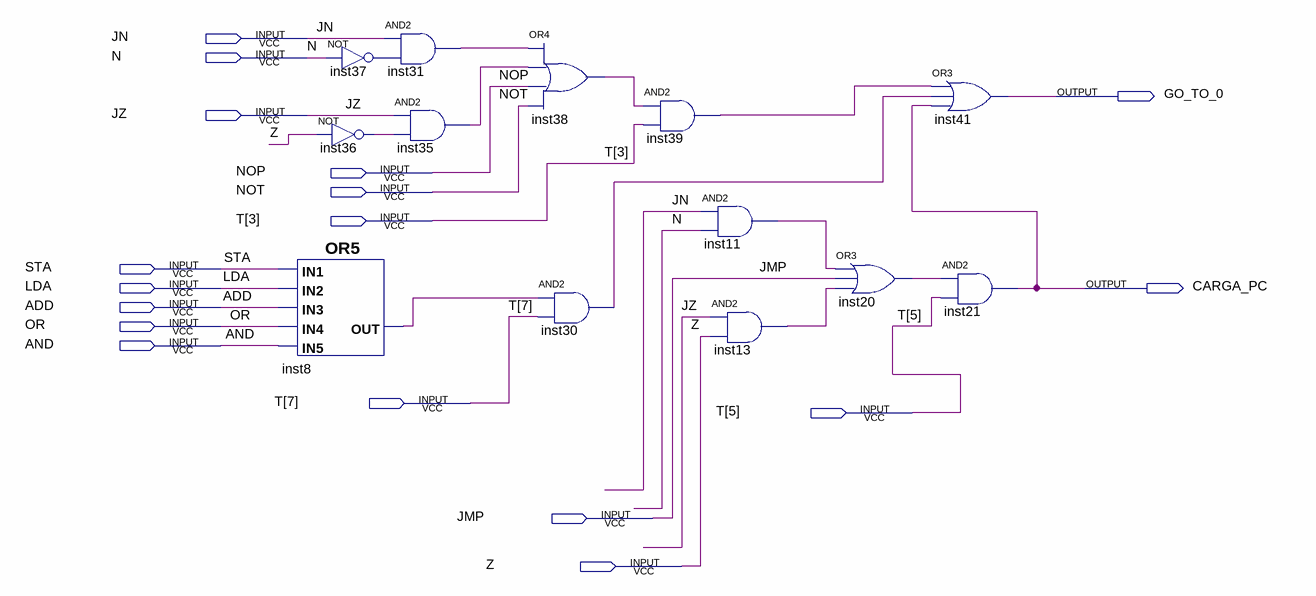
[diagram p0: schematic sheet]
// Quartus schematic UNIDADE_CONTROLE_GOTO0_CARGA_PC.bdf as structural Verilog: 13 symbols, 17 pins
module UNIDADE_CONTROLE_GOTO0_CARGA_PC (
  input  JN,
  input  N,
  input  JZ,
  input  NOP,
  input  NOT,
  input  [7:3] T,
  input  STA,
  input  LDA,
  input  ADD,
  input  OR,
  input  AND,
  input  JMP,
  input  Z,
  output GO_TO_0,
  output CARGA_PC
);

  wire inst8_out, inst11_out, inst13_out, inst20_out, inst30_out, inst31_out, inst35_out, inst36_out,
       inst37_out, inst38_out, inst39_out;

  or inst8 (inst8_out, STA, LDA, ADD, OR, AND);
  not inst37 (inst37_out, N);
  not inst36 (inst36_out, Z);
  and inst31 (inst31_out, JN, inst37_out);
  and inst35 (inst35_out, JZ, inst36_out);
  or inst38 (inst38_out, inst31_out, inst35_out, NOP, NOT);
  and inst30 (inst30_out, inst8_out, T[7]);
  and inst39 (inst39_out, inst38_out, T[3]);
  and inst11 (inst11_out, JN, N);
  and inst13 (inst13_out, JZ, Z);
  or inst20 (inst20_out, inst11_out, JMP, inst13_out);
  or inst41 (GO_TO_0, inst39_out, inst30_out, CARGA_PC);
  and inst21 (CARGA_PC, inst20_out, T[5]);
endmodule
